# Altium project PV Refridgerator.PrjPCB (part 1 of 3)
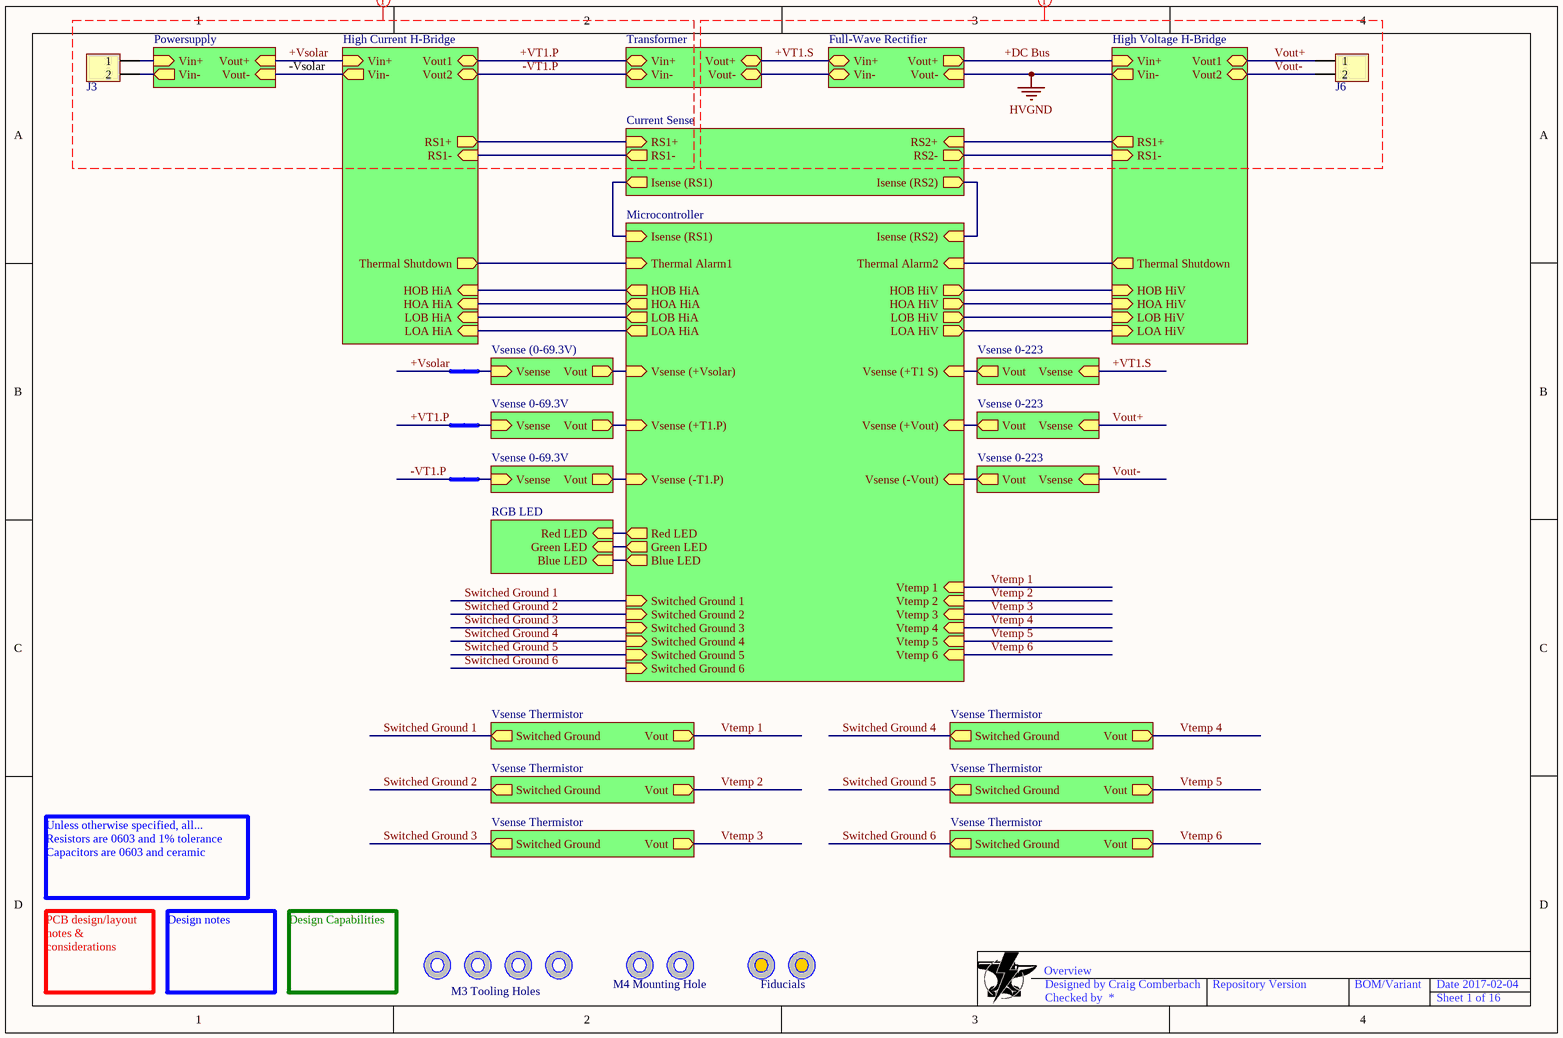
[diagram p0: Overview.SchDoc]
Designer: Craig Comberbach; ProjectRevision: v0.1.3; ProjectTitle: PV Refridgerator
19 sheets, 199 parts. Net scope: hierarchical (ports join the sheet entries above them; power ports are global).
Board file: PV Refridgerator v0.1.3.PCBDOC
Sheets:
  Overview.SchDoc
    High Current H-Bridge = High Current H-Bridge.SchDoc
      Half H-Bridge Driver = Half H-Bridge Driver.SchDoc
      Half H-Bridge Driver = Half H-Bridge Driver.SchDoc
      Emergency Thermal Shutdown = Emergency Thermal Shutdown.SchDoc
    Full-Wave Rectifier = Full-Wave Rectifier.schdoc
    High Voltage H-Bridge = High Voltage H-Bridge.SchDoc
      Half H-Bridge Driver = Half H-Bridge Driver.SchDoc
      Half H-Bridge Driver = Half H-Bridge Driver.SchDoc
      Emergency Thermal Shutdown = Emergency Thermal Shutdown.SchDoc
    Transformer = Transformer.SchDoc
    Powersupply = Powersupply.SchDoc
      15VDC 500mA Boost SMPS = 15VDC 500mA Boost SMPS.SchDoc
      3.3VDC 250mA Linear PS = 3.3VDC 250mA Linear PS.SchDoc
      5VDC 250mA Buck SMPS = 5VDC 250mA Buck SMPS.SchDoc
    Microcontroller = Microcontroller.SchDoc
      ICSP = ICSP.SchDoc
    RGB LED = RGB LED.SchDoc
    Vsense 0-69.3V = Vsense 0-69.3V.SchDoc
    Vsense 0-223 = Vsense 0-223.3V.SchDoc
    Vsense Thermistor = Vsense Thermistor.SchDoc
    Current Sense = Current Sense.SchDoc
    Vsense (0-69.3V) = Vsense 0-69.3V.SchDoc
    Vsense 0-69.3V = Vsense 0-69.3V.SchDoc
    Vsense 0-223 = Vsense 0-223.3V.SchDoc
    Vsense 0-223 = Vsense 0-223.3V.SchDoc
    Vsense Thermistor = Vsense Thermistor.SchDoc
    Vsense Thermistor = Vsense Thermistor.SchDoc
    Vsense Thermistor = Vsense Thermistor.SchDoc
    Vsense Thermistor = Vsense Thermistor.SchDoc
    Vsense Thermistor = Vsense Thermistor.SchDoc
  Reverse Voltage Protection.SchDoc

## Sheet Overview.SchDoc: Overview
size A4; Date: 2017-02-04; DocumentNumber: 1; Revision: C; SheetNumber: 1; SheetTotal: 16; DesignedBy: Craig Comberbach

### Parts
FID1  Fiducials  [Fiducial]  (no BOM)
FID3  Fiducial  [Fiducial]  (value not drawn)  (no BOM)
J3  Terminal Block - 2-Position HiV/HiA  [TE 796739-2]  (value not drawn)
J6  Terminal Block - 2-Position HiV/HiA  [TE 796739-2]  (value not drawn)
MountingHole1  M3 Tooling Holes  [M3 Screw - One Sided]  (no BOM)
MountingHole2  Mounting Hole  [M3 Screw - One Sided]  (value not drawn)  (no BOM)
MountingHole3  Mounting Hole  [M4 Screw - One Sided]  (value not drawn)  (no BOM)
MountingHole4  M4 Mounting Hole  [M4 Screw - One Sided]  (no BOM)
MountingHole5  Mounting Hole  [M3 Screw - One Sided]  (value not drawn)  (no BOM)
MountingHole6  Mounting Hole  [M3 Screw - One Sided]  (value not drawn)  (no BOM)
NetTie7  Net Tie - Same Size  (value not drawn)  (net tie, no BOM)
NetTie8  Net Tie - Same Size  (value not drawn)  (net tie, no BOM)
NetTie9  Net Tie - Same Size  (value not drawn)  (net tie, no BOM)

### Sub-sheets
Current Sense = Current Sense.SchDoc: RS1+ (in), RS1- (out), RS2+ (in), RS2- (out), Isense (RS1) (out), Isense (RS2) (out)
Full-Wave Rectifier = Full-Wave Rectifier.SchDoc: Vin+ (bidir), Vin- (bidir), Vout+ (out), Vout- (in)
High Current H-Bridge = High Current H-Bridge.SchDoc: Vout1 (bidir), Vout2 (bidir), Vin+ (in), Vin- (out), RS1+ (out), RS1- (in), HOB HiA (in), LOB HiA (in), LOA HiA (in), HOA HiA (in), Thermal Shutdown (out)
High Voltage H-Bridge = High Voltage H-Bridge.SchDoc: Vout1 (bidir), Vout2 (bidir), Vin+ (in), Vin- (out), RS1+ (out), RS1- (in), HOB HiV (in), HOA HiV (in), LOA HiV (in), LOB HiV (in), Thermal Shutdown (out)
Microcontroller = Microcontroller.SchDoc: Red LED (out), Green LED (out), Blue LED (out), Vsense (+T1.P) (in), Vsense (+Vsolar) (in), Vsense (-T1.P) (in), Vsense (+T1 S) (in), Vtemp 6 (in), Vsense (+Vout) (in), Vsense (-Vout) (in), Vtemp 1 (in), Vtemp 2 (in), Vtemp 3 (in), Vtemp 4 (in), Vtemp 5 (in), Isense (RS1) (in), Isense (RS2) (in), Switched Ground 1 (in), Switched Ground 2 (in), Switched Ground 3 (in), Switched Ground 4 (in), Switched Ground 5 (in), HOB HiA (out), LOB HiA (out), LOA HiA (out), HOA HiA (out), HOB HiV (out), HOA HiV (out), LOA HiV (out), LOB HiV (out), Switched Ground 6 (in), Thermal Alarm1 (in), Thermal Alarm2 (in)
Powersupply = Powersupply.SchDoc: Vin+ (in), Vin- (out), Vout- (in), Vout+ (in)
RGB LED = RGB LED.SchDoc: Red LED (in), Green LED (in), Blue LED (in)
Transformer = Transformer.SchDoc: Vin+ (bidir), Vin- (bidir), Vout+ (bidir), Vout- (bidir)
Vsense 0-69.3V = Vsense 0-69.3V.SchDoc: Vsense (in), Vout (out)
Vsense 0-69.3V = Vsense 0-69.3V.SchDoc: Vsense (in), Vout (out)
Vsense 0-223 = Vsense 0-223.3V.SchDoc: Vsense (in), Vout (out)
Vsense 0-223 = Vsense 0-223.3V.SchDoc: Vsense (in), Vout (out)
Vsense 0-223 = Vsense 0-223.3V.SchDoc: Vsense (in), Vout (out)
Vsense (0-69.3V) = Vsense 0-69.3V.SchDoc: Vsense (in), Vout (out)
Vsense Thermistor = Vsense Thermistor.SchDoc: Switched Ground (out), Vout (out)
Vsense Thermistor = Vsense Thermistor.SchDoc: Switched Ground (out), Vout (out)
Vsense Thermistor = Vsense Thermistor.SchDoc: Switched Ground (out), Vout (out)
Vsense Thermistor = Vsense Thermistor.SchDoc: Switched Ground (out), Vout (out)
Vsense Thermistor = Vsense Thermistor.SchDoc: Switched Ground (out), Vout (out)
Vsense Thermistor = Vsense Thermistor.SchDoc: Switched Ground (out), Vout (out)

### Nets
HVGND: sheet Full-Wave Rectifier/Vout-, sheet High Voltage H-Bridge/Vin-, sheet High Voltage H-Bridge/RS1-, sheet Current Sense/RS2-
+DC Bus: sheet Full-Wave Rectifier/Vout+, sheet High Voltage H-Bridge/Vin+
+Vsolar: J3.1 NetTie7.1 ; sheet High Current H-Bridge/Vin+, sheet Powersupply/Vin+, sheet Powersupply/Vout+
+VT1.P: NetTie8.1 ; sheet High Current H-Bridge/Vout1, sheet Transformer/Vin+
+VT1.S: sheet Full-Wave Rectifier/Vin+, sheet Transformer/Vout+, sheet Vsense 0-223/Vsense
-Vsolar: J3.2 ; sheet High Current H-Bridge/Vin-, sheet High Current H-Bridge/RS1-, sheet Powersupply/Vin-, sheet Powersupply/Vout-, sheet Current Sense/RS1-
-VT1.P: NetTie9.1 ; sheet High Current H-Bridge/Vout2, sheet Transformer/Vin-
Isense (RS1): sheet Microcontroller/Isense (RS1), sheet Current Sense/Isense (RS1)
Isense (RS2): sheet Microcontroller/Isense (RS2), sheet Current Sense/Isense (RS2)
Switched Ground 1: sheet Microcontroller/Switched Ground 1, sheet Vsense Thermistor/Switched Ground
Switched Ground 2: sheet Microcontroller/Switched Ground 2, sheet Vsense Thermistor/Switched Ground
Switched Ground 3: sheet Microcontroller/Switched Ground 3, sheet Vsense Thermistor/Switched Ground
Switched Ground 4: sheet Microcontroller/Switched Ground 4, sheet Vsense Thermistor/Switched Ground
Switched Ground 5: sheet Microcontroller/Switched Ground 5, sheet Vsense Thermistor/Switched Ground
Switched Ground 6: sheet Microcontroller/Switched Ground 6, sheet Vsense Thermistor/Switched Ground
Vout+: J6.1 ; sheet High Voltage H-Bridge/Vout1, sheet Vsense 0-223/Vsense  [project net C_VS]
Vout-: J6.2 ; sheet High Voltage H-Bridge/Vout2, sheet Vsense 0-223/Vsense  [project net D_VS]
Vsense (+T1 S): sheet Microcontroller/Vsense (+T1 S), sheet Vsense 0-223/Vout
Vsense (+T1.P): sheet Microcontroller/Vsense (+T1.P), sheet Vsense 0-69.3V/Vout
Vsense (+Vout): sheet Microcontroller/Vsense (+Vout), sheet Vsense 0-223/Vout
Vsense (+Vsolar): sheet Microcontroller/Vsense (+Vsolar), sheet Vsense (0-69.3V)/Vout
Vsense (-T1.P): sheet Microcontroller/Vsense (-T1.P), sheet Vsense 0-69.3V/Vout
Vsense (-Vout): sheet Microcontroller/Vsense (-Vout), sheet Vsense 0-223/Vout
Vtemp 1: sheet Microcontroller/Vtemp 1, sheet Vsense Thermistor/Vout
Vtemp 2: sheet Microcontroller/Vtemp 2, sheet Vsense Thermistor/Vout
Vtemp 3: sheet Microcontroller/Vtemp 3, sheet Vsense Thermistor/Vout
Vtemp 4: sheet Microcontroller/Vtemp 4, sheet Vsense Thermistor/Vout
Vtemp 5: sheet Microcontroller/Vtemp 5, sheet Vsense Thermistor/Vout
Vtemp 6: sheet Microcontroller/Vtemp 6, sheet Vsense Thermistor/Vout
NetD2_1: sheet Full-Wave Rectifier/Vin-, sheet Transformer/Vout-
NetD5_1: sheet Microcontroller/Red LED, sheet RGB LED/Red LED
NetD6_1: sheet Microcontroller/Green LED, sheet RGB LED/Green LED
NetD7_1: sheet Microcontroller/Blue LED, sheet RGB LED/Blue LED
NetNetTie3_2: sheet High Current H-Bridge/RS1+, sheet Current Sense/RS1+
NetNetTie5_2: sheet High Voltage H-Bridge/RS1+, sheet Current Sense/RS2+
NetNetTie7_2: NetTie7.2 ; sheet Vsense (0-69.3V)/Vsense
NetNetTie8_2: NetTie8.2 ; sheet Vsense 0-69.3V/Vsense
NetNetTie9_2: NetTie9.2 ; sheet Vsense 0-69.3V/Vsense
NetR1A_1: sheet High Current H-Bridge/Thermal Shutdown, sheet Microcontroller/Thermal Alarm1
NetR1B_1: sheet High Voltage H-Bridge/Thermal Shutdown, sheet Microcontroller/Thermal Alarm2
NetU1#2_31: sheet High Voltage H-Bridge/LOA HiV, sheet Microcontroller/LOA HiV
NetU1#2_32: sheet High Voltage H-Bridge/LOB HiV, sheet Microcontroller/LOB HiV
NetU1#2_33: sheet High Voltage H-Bridge/HOA HiV, sheet Microcontroller/HOA HiV
NetU1#2_34: sheet High Voltage H-Bridge/HOB HiV, sheet Microcontroller/HOB HiV
NetU1#2_42: sheet High Current H-Bridge/HOA HiA, sheet Microcontroller/HOA HiA
NetU1#2_46: sheet High Current H-Bridge/HOB HiA, sheet Microcontroller/HOB HiA
NetU1#2_52: sheet High Current H-Bridge/LOB HiA, sheet Microcontroller/LOB HiA
NetU1#2_53: sheet High Current H-Bridge/LOA HiA, sheet Microcontroller/LOA HiA

### Layout directives
net class 15A: +Vsolar, +VT1.P, -Vsolar, -VT1.P
net class 171-250V: +DC Bus, +VT1.S, HVGND, Vout+, Vout-

### Notes on the sheet
- Unless otherwise specified, all...
  Resistors are 0603 and 1% tolerance
  Capacitors are 0603 and ceramic
- PCB design/layout notes & considerations
- Design notes
- (near MountingHole1) Design Capabilities
- Repository Version
- BOM/Variant

### Library data of the parts
FID1 = Fiducial: Value: Fiducial
J3 J6 = Terminal Block - 2-Position HiV/HiA: Manufacturer: TE Connectivity AMP Connectors; Manufacturer Part Number: 796739-2; Number of Levels: 1; Positions Per Level: 2; Pitch: 0.375" (9.53mm); Mating Orientation: Horizontal with Board; Current: 30A; Voltage: 600V; Wire Gauge: 10-30 AWG; Wire Termination: Screw - Rising Cage Clamp; Clamp Material - Plating: Brass - Nickel Plated; Torque - Screw: 0.79 Nm (7.0 Lb-In); Screw Thread: M3; Supplier 1: Digi-Key; RoHS: RoHS Compliant; Category: Connectors, Interconnects; Stock 1: 14124; Pricing 1: 1=2.21, 10=1.673, 25=1.5504, 50=1.394, 100=1.36, 250=1.19, 500=1.088, 1000=0.986, 2500=0.884 (USD); Packaging: Tray; Part Status: Active; Mounting Type: Through Hole; Features: Interlocking (Side); Color: Green; Operating Temperature: -; Housing Material: Polyamide (PA66), Nylon 6/6; Contact Material - Plating: -; Screw Material - Plating: Brass - Nickel Plated; ComponentLink1URL: http://www.te.com/commerce/DocumentDelivery/DDEController?Action=srchrtrv&DocNm=796739&DocType=Customer+Drawing&DocLang=English; ComponentLink1Description: Spec Sheet; Supplier Part Number 1: A98273-ND
MountingHole1 MountingHole4 = Mounting Hole
NetTie7-NetTie9 = Net Tie - Same Size: Ties two nets together
FID3 = Fiducial: Value: Fiducial

## Sheet High Current H-Bridge.SchDoc: Title
size A4; Date: Date; CheckedBy: Checked By; SheetNumber: x; SheetTotal: y; DesignedBy: Designed By
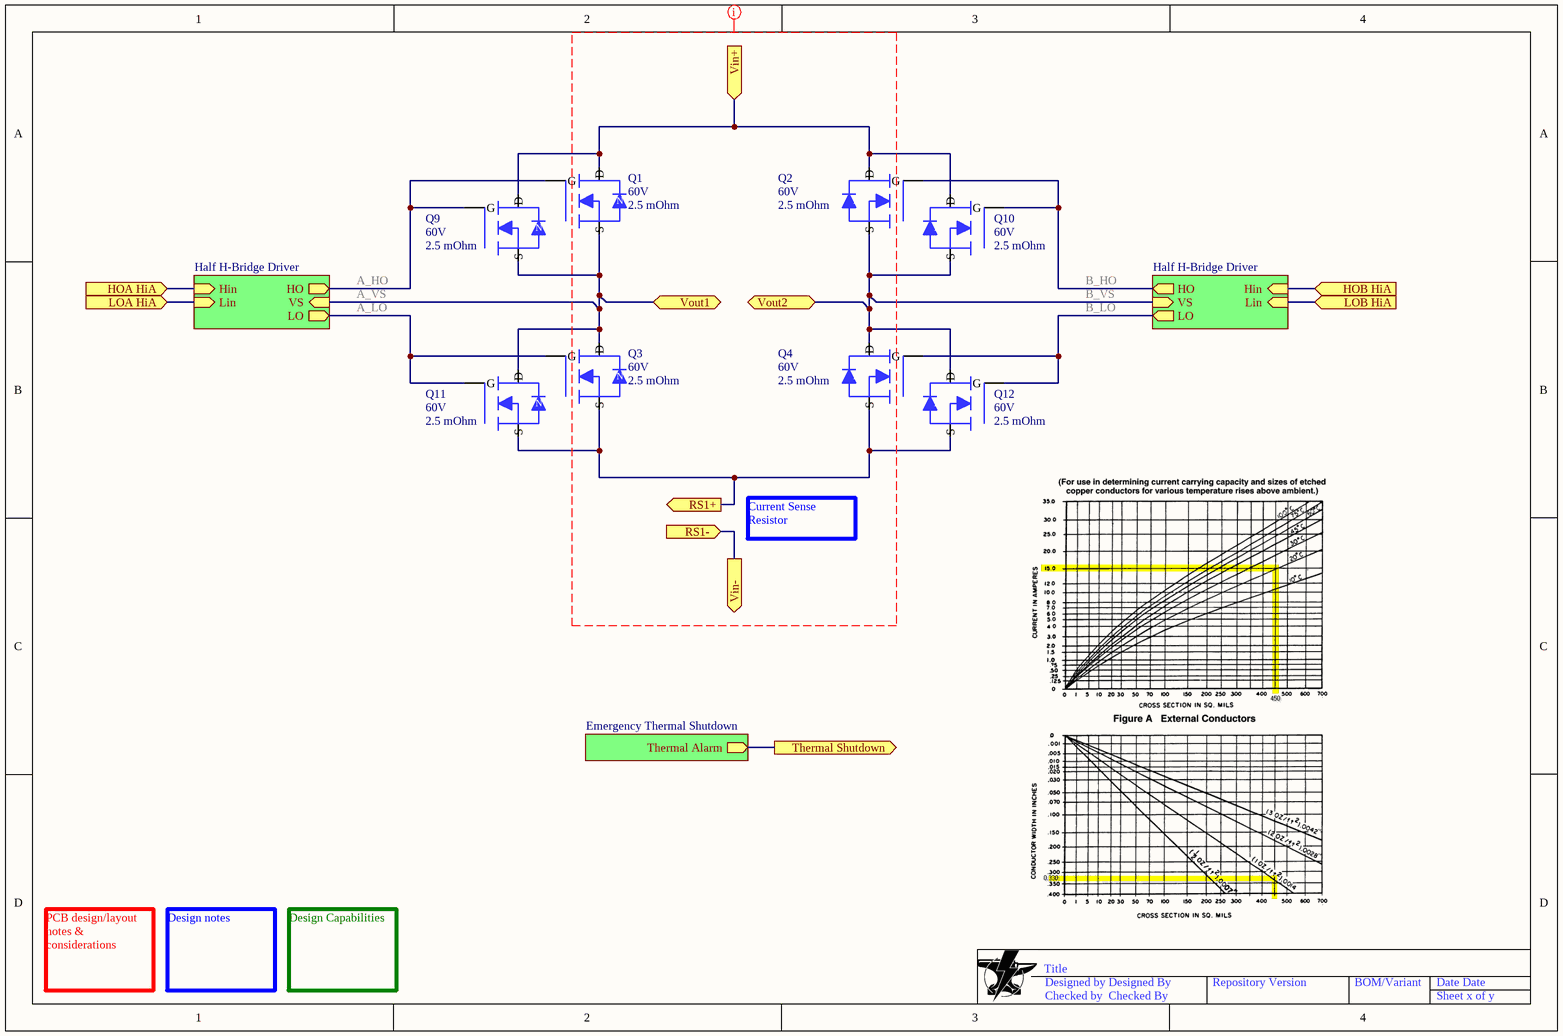
[diagram p1: High Current H-Bridge.SchDoc]

### Parts
Q1  Drain to Source Voltage (Vdss): 60V  Rds On (Max) @ Id, Vgs: 2.5 mOhm  [DPAK]  (hidden comment: N-MOSFET)
Q2  Drain to Source Voltage (Vdss): 60V  Rds On (Max) @ Id, Vgs: 2.5 mOhm  [DPAK]  (hidden comment: N-MOSFET)
Q3  Drain to Source Voltage (Vdss): 60V  Rds On (Max) @ Id, Vgs: 2.5 mOhm  [DPAK]  (hidden comment: N-MOSFET)
Q4  Drain to Source Voltage (Vdss): 60V  Rds On (Max) @ Id, Vgs: 2.5 mOhm  [DPAK]  (hidden comment: N-MOSFET)
Q9  Drain to Source Voltage (Vdss): 60V  Rds On (Max) @ Id, Vgs: 2.5 mOhm  [DPAK]  (hidden comment: N-MOSFET)
Q10  Drain to Source Voltage (Vdss): 60V  Rds On (Max) @ Id, Vgs: 2.5 mOhm  [DPAK]  (hidden comment: N-MOSFET)
Q11  Drain to Source Voltage (Vdss): 60V  Rds On (Max) @ Id, Vgs: 2.5 mOhm  [DPAK]  (hidden comment: N-MOSFET)
Q12  Drain to Source Voltage (Vdss): 60V  Rds On (Max) @ Id, Vgs: 2.5 mOhm  [DPAK]  (hidden comment: N-MOSFET)

### Sub-sheets
Emergency Thermal Shutdown = Emergency Thermal Shutdown.SchDoc: Thermal Alarm (out)
Half H-Bridge Driver = Half H-Bridge Driver.SchDoc: HO (out), VS (in), LO (out), Hin (in), Lin (in)
Half H-Bridge Driver = Half H-Bridge Driver.SchDoc: HO (out), VS (in), LO (out), Hin (in), Lin (in)

### Ports
HOA HiA (in), HOB HiA (in), LOA HiA (in), LOB HiA (in), RS1+ (out), RS1- (in), Thermal Shutdown (out), Vin+ (in), Vin- (out), Vout1 (bidir), Vout2 (bidir)

### Nets
+Vsolar: Q1.2(D) Q2.2(D) Q9.2(D) Q10.2(D) ; port Vin+
-Vsolar: port Vin-, port RS1-
A_HO: Q1.1(G) Q9.1(G) ; sheet Half H-Bridge Driver/HO
A_LO: Q3.1(G) Q11.1(G) ; sheet Half H-Bridge Driver/LO
A_VS: Q1.3(S) Q3.2(D) Q9.3(S) Q11.2(D) ; port Vout1, sheet Half H-Bridge Driver/VS  [project net +VT1.P]
B_HO: Q2.1(G) Q10.1(G) ; sheet Half H-Bridge Driver/HO
B_LO: Q4.1(G) Q12.1(G) ; sheet Half H-Bridge Driver/LO
B_VS: Q2.3(S) Q4.2(D) Q10.3(S) Q12.2(D) ; port Vout2, sheet Half H-Bridge Driver/VS  [project net -VT1.P]
NetNetTie3_2: Q3.3(S) Q4.3(S) Q11.3(S) Q12.3(S) ; port RS1+
NetR1A_1: port Thermal Shutdown, sheet Emergency Thermal Shutdown/Thermal Alarm
NetU1#2_42: port HOA HiA, sheet Half H-Bridge Driver/Hin
NetU1#2_46: port HOB HiA, sheet Half H-Bridge Driver/Hin
NetU1#2_52: port LOB HiA, sheet Half H-Bridge Driver/Lin
NetU1#2_53: port LOA HiA, sheet Half H-Bridge Driver/Lin

### Layout directives
net class 15A: (no net found under the mark)

### Notes on the sheet
- Current Sense Resistor
- PCB design/layout notes & considerations
- Design notes
- Design Capabilities
- Repository Version
- BOM/Variant
- (in symbol N-MOSFET 2.5mR 60V) N

### Library data of the parts
Q1-Q4 Q9-Q12 = N-MOSFET 2.5mR 60V: Manufacturer: Infineon Technologies; Manufacturer Part Number: IPD025N06N; FET Type: N-Channel; Current - Continuous Drain (Id) @ 25°C: 90A; Drive Voltage (Max Rds On,  Min Rds On): 6V, 10V; Vgs(th) (Max) @ Id: 2.8V @ 95µA; Gate Charge (Qg) (Max) @ Vgs: 71nC @ 10V; Input Capacitance (Ciss) (Max) @ Vds: 5200pF @ 30V; Vgs (Max): ±20V; Power Dissipation (Max): 3W (Ta), 167W (Tc); Supplier 1: Digi-Key; Supplier Part Number 1: IPD025N06NCT-ND; RoHS: RoHS Compliant; Category: Discrete Semiconductor Products; Stock 1: 5405; Pricing 1: 1=1.91, 10=1.72, 100=1.3822, 500=1.13558, 1000=0.94091 (USD); Packaging: Cut Tape (CT); Part Status: Active; Technology: MOSFET (Metal Oxide); FET Feature: -; Operating Temperature: -55°C ~ 175°C (TJ); Mounting Type: Surface Mount; Supplier Device Package: PG-TO252-3; Package / Case: TO-252-3, DPak (2 Leads + Tab), SC-63; ComponentLink1URL: http://www.infineon.com/dgdl/IPD025N06N_Rev2+1.pdf?folderId=db3a304313b8b5a60113cee8763b02d7&fileId=db3a304336415dec0136531648062c76; ComponentLink1Description: Spec Sheet; Value: N-MOSFET 2.5mR

## Sheet Half H-Bridge Driver.SchDoc: N-FET Driver
size A4; Date: 2017-02-04; DocumentNumber: 3; Revision: A; SheetNumber: 3; SheetTotal: 16; DesignedBy: Mike MacKay
Used 4 times, as channels High Current H-Bridge/Half H-Bridge Driver, High Current H-Bridge/Half H-Bridge Driver, High Voltage H-Bridge/Half H-Bridge Driver, High Voltage H-Bridge/Half H-Bridge Driver. Parts and nets are listed once, with the designators drawn on the sheet.
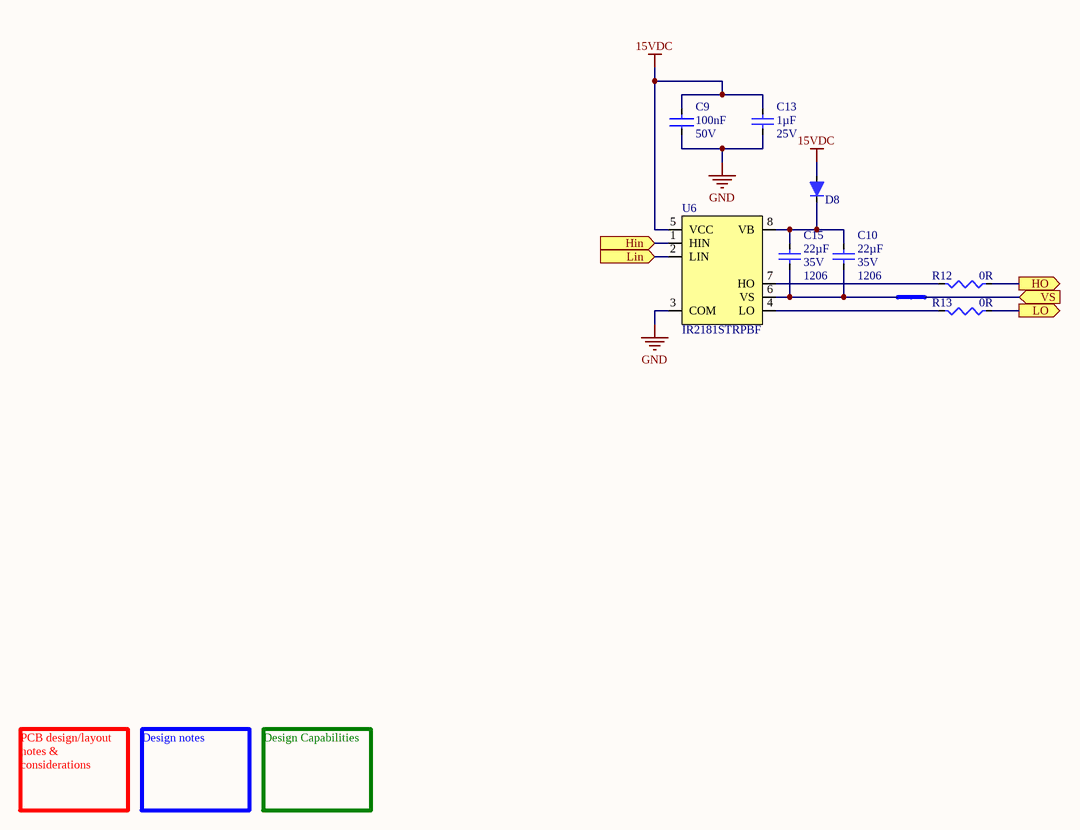
[diagram p2: Half H-Bridge Driver.SchDoc]

### Parts
C9  Voltage - Rated: 50V  Capacitance: 100nF  [C0603 - Ceramic]  (hidden comment: 100nF 0603 50V)
C10  Capacitance: 22µF  Voltage - Rated: 35V  Package / Case: 1206  (hidden comment: 22uF 1206 35V)
C13  Voltage - Rated: 25V  Capacitance: 1µF  [Capacitor - 0603 Ceramic]  (hidden comment: 1uF 0603 25V)
C15  Voltage - Rated: 35V  Package / Case: 1206  Capacitance: 22µF  (hidden comment: 22uF 1206 35V)
D8  (no value)
NetTie1  Net Tie - Same Size  (value not drawn)  (net tie, no BOM)
R12  Resistance (Ohms): 0R  [R0603]  (hidden comment: 0R 0603)
R13  Resistance (Ohms): 0R  [R0603]  (hidden comment: 0R 0603)
U6  Manufacturer Part Number: IR2181STRPBF  [SOIC-8]  (hidden comment: H-Bridge Driver)

### Ports
Hin (in), HO (out), Lin (in), LO (out), VS (in)

### Nets
15VDC: C9.1 C13.1 D8.1(Anode) U6.5(VCC)
GND: C9.2 C13.2 U6.3(COM)
Hin: U6.1(HIN) ; port Hin
HO: R12.2 ; port HO
Lin: U6.2(LIN) ; port Lin
LO: R13.2 ; port LO
VS: NetTie1.1 ; port VS
NetC10_1: C10.1 C15.1 D8.2(Cathode) U6.8(VB)
NetC10_2: C10.2 C15.2 NetTie1.2 U6.6(VS)
NetR12_1: R12.1 U6.7(HO)
NetR13_1: R13.1 U6.4(LO)

### Channels
High Current H-Bridge/Half H-Bridge Driver: designators end in A; ports Hin=NetU1#2_42 HO=A_HO Lin=NetU1#2_53 LO=A_LO VS=+VT1.P
High Current H-Bridge/Half H-Bridge Driver: designators end in B; ports Hin=NetU1#2_46 HO=B_HO Lin=NetU1#2_52 LO=B_LO VS=-VT1.P
High Voltage H-Bridge/Half H-Bridge Driver: designators end in C; ports Hin=NetU1#2_33 HO=C_HO Lin=NetU1#2_31 LO=C_LO VS=C_VS
High Voltage H-Bridge/Half H-Bridge Driver: designators end in D; ports Hin=NetU1#2_34 HO=D_HO Lin=NetU1#2_32 LO=D_LO VS=D_VS

### Notes on the sheet
- PCB design/layout notes & considerations
- Design notes
- Design Capabilities
- Repository Version
- BOM/Variant

### Library data of the parts
C9 = 100nF 0603 50V: Manufacturer: Samsung Electro-Mechanics America, Inc; Manufacturer Part Number: CL10B104KB8SFNC; Tolerance: ±10%; Temperature Coefficient: X7R; Value: 100nF 0603 50V; Supplier 1: Digi-Key; RoHS: RoHS Compliant; Category: Capacitors; Stock 1: 1192070; Pricing 1: 1=0.1, 10=0.027, 25=0.0192, 100=0.0125, 500=0.00874, 1000=0.00681 (USD); Packaging: Cut Tape (CT); Mounting Type: Surface Mount, MLCC; Operating Temperature: -55°C ~ 125°C; Applications: Boardflex Sensitive; Ratings: -; Package / Case: 0603 (1608 Metric); Size / Dimension: 0.063" L x 0.031" W (1.60mm x 0.80mm); Height - Seated (Max): -; Thickness (Max): 0.035" (0.90mm); Lead Spacing: -; Features: Soft Termination; Lead Style: -; ComponentLink1URL: http://www.samsungsem.com/kr/front/downloadcms.do?path=/kr/support/product-search/mlcc/__icsFiles/afieldfile/2014/11/05&fileName=S_CL10B104KB8SFNC.pdf; ComponentLink1Description: Spec Sheet; Supplier Part Number 1: 1276-1936-1-ND
C10 C15 = 22uF 1206 35V: Non-polarized; Manufacturer: TDK Corporation; Manufacturer Part Number: C3216X5R1V226M160AC; Tolerance: ±20%; Temperature Coefficient: X5R; Value: 22uF 1206 35V; Supplier 1: Digi-Key; RoHS: RoHS Compliant; Category: Capacitors; Stock 1: 661971; Pricing 1: 1=1.06, 10=0.835, 100=0.6262, 500=0.47312, 1000=0.41745 (USD); Packaging: Cut Tape (CT); Part Status: Active; Operating Temperature: -55°C ~ 85°C; Features: Low ESL; Ratings: -; Applications: General Purpose; Failure Rate: -; Mounting Type: Surface Mount, MLCC; Size / Dimension: 0.126" L x 0.063" W (3.20mm x 1.60mm); Height - Seated (Max): -; Thickness (Max): 0.071" (1.80mm); Lead Spacing: -; Lead Style: -; ComponentLink1URL: https://product.tdk.com/info/en/catalog/datasheets/mlcc_commercial_general_en.pdf; ComponentLink1Description: Spec Sheet; Supplier Part Number 1: 445-8045-1-ND
C13 = 1uF 0603 25V: Non-polarized; Manufacturer: Murata Electronics North America; Manufacturer Part Number: GRM188R61E105KA12D; Value: 1uF 0603 16V; Tolerance: ±10%; Temperature Coefficient: X5R; Supplier 1: Digi-Key; RoHS: RoHS Compliant; Category: Capacitors; Stock 1: 1582906; Pricing 1: 1=0.14, 10=0.059, 50=0.0322, 100=0.0273, 250=0.02232, 500=0.01908, 1000=0.01488 (CAD); Packaging: Cut Tape (CT); Mounting Type: Surface Mount, MLCC; Operating Temperature: -55°C ~ 85°C; Applications: General Purpose; Ratings: -; Package / Case: 0603 (1608 Metric); Size / Dimension: 0.063" L x 0.031" W (1.60mm x 0.80mm); Height - Seated (Max): -; Thickness (Max): 0.035" (0.90mm); Lead Spacing: -; Features: -; Lead Style: -; ComponentLink1URL: http://www.murata.com/~/media/webrenewal/support/library/catalog/products/capacitor/mlcc/c02e.ashx; ComponentLink1Description: Spec Sheet; Supplier Part Number 1: 490-3897-1-ND
D8 = Diode - Signal 1A: Signal Diode; Manufacturer: Vishay Semiconductor Diodes Division; Manufacturer Part Number: US1G-E3/5AT; Diode Type: Standard; Voltage - DC Reverse (Vr) (Max): 400V; Current - Average Rectified (Io): 1A; Voltage - Forward (Vf) (Max) @ If: 1V @ 1A; Speed: Fast Recovery =< 500ns, > 200mA (Io); Reverse Recovery Time (trr): 50ns; Current - Reverse Leakage @ Vr: 10µA @ 400V; Capacitance @ Vr, F: 15pF @ 4V, 1MHz; Supplier 1: Digi-Key; Supplier Part Number 1: US1G-E3/5ATGICT-ND; RoHS: RoHS Compliant; Category: Discrete Semiconductor Products; Stock 1: 29002; Pricing 1: 1=0.41, 10=0.312, 25=0.2816, 100=0.1945, 250=0.1638, 500=0.1331, 1000=0.10238, 2500=0.09214 (USD); Packaging: Cut Tape (CT); Part Status: Active; Mounting Type: Surface Mount; Package / Case: DO-214AC, SMA; ComponentLink1URL: http://www.vishay.com/docs/88768/us1.pdf; ComponentLink1Description: Spec Sheet; Supplier Device Package: DO-214AC (SMA); Operating Temperature - Junction: -55°C ~ 150°C
NetTie1 = Net Tie - Same Size: Ties two nets together
R12 R13 = 0R 0603: Manufacturer: Yageo; Manufacturer Part Number: RC0603JR-070RL; Tolerance: Jumper; Power (Watts): 0.1W, 1/10W; Value: 0R 0603; Supplier 1: Digi-Key; Supplier Part Number 1: 311-0.0GRCT-ND; RoHS: RoHS Compliant; Category: Resistors; Stock 1: 9876788; Pricing 1: 1=0.1, 10=0.01, 25=0.0072, 50=0.0056, 100=0.0041, 250=0.00316, 500=0.00252, 1000=0.00186 (USD); Packaging: Cut Tape (CT); Part Status: Active; Composition: Thick Film; Features: Moisture Resistant; Temperature Coefficient: -; Operating Temperature: -55°C ~ 155°C; Package / Case: 0603 (1608 Metric); Supplier Device Package: 0603; Size / Dimension: 0.063" L x 0.031" W (1.60mm x 0.80mm); Height - Seated (Max): 0.022" (0.55mm); Failure Rate: -; ComponentLink1URL: http://www.yageo.com/documents/recent/PYu-RC_Group_51_RoHS_L_7.pdf; ComponentLink1Description: Spec Sheet
U6 = H-Bridge Driver: Manufacturer: Infineon Technologies; Driven Configuration: Half-Bridge; Channel Type: Independent; Gate Type: IGBT, N-Channel MOSFET; Voltage - Supply: 10 V ~ 20 V; Logic Voltage - VIL, VIH: 0.8V, 2.7V; Current - Peak Output (Source, Sink): 1.9A, 2.3A; Input Type: Non-Inverting; High Side Voltage - Max (Bootstrap): 600V; Rise / Fall Time (Typ): 40ns, 20ns; Supplier 1: Digi-Key; RoHS: RoHS Compliant; Category: Integrated Circuits (ICs); Stock 1: 2915; Pricing 1: 1=3.06, 10=2.75, 100=2.2535, 500=1.9184, 1000=1.61792 (USD); Packaging: Cut Tape (CT); Part Status: Active; Operating Temperature: -40°C ~ 150°C (TJ); Mounting Type: Surface Mount; Package / Case: 8-SOIC (0.154", 3.90mm Width); Supplier Device Package: 8-SOIC; ComponentLink1URL: http://www.irf.com/product-info/datasheets/data/ir2181.pdf; ComponentLink1Description: Spec Sheet; Supplier Part Number 1: IR2181SPBFCT-ND

## Sheet Emergency Thermal Shutdown.SchDoc: Emergency Thermal Shutdown
size A4; Date: 2017-08-06; Revision: A; DesignedBy: Craig Comberbach
Used 2 times, as channels High Current H-Bridge/Emergency Thermal Shutdown, High Voltage H-Bridge/Emergency Thermal Shutdown. Parts and nets are listed once, with the designators drawn on the sheet.
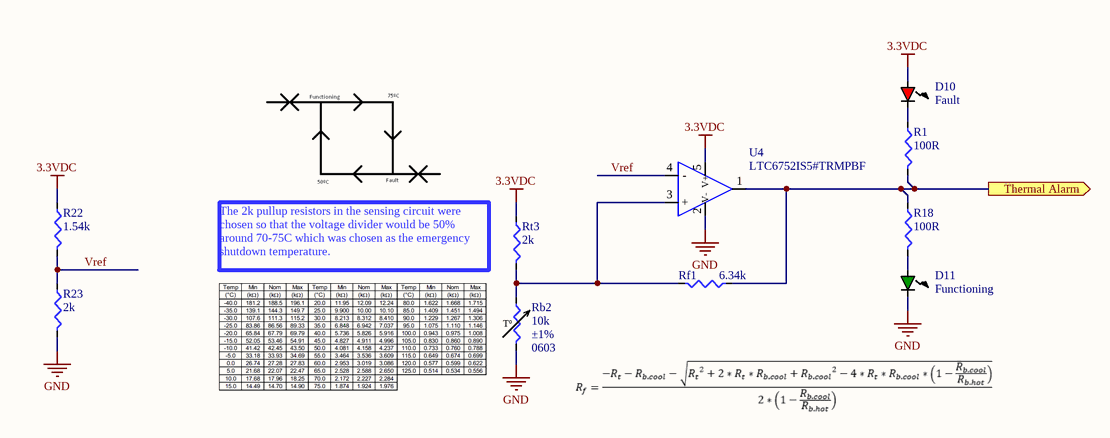
[diagram p3: Emergency Thermal Shutdown.SchDoc]

### Parts
D10  Fault  [LED - 1206 Red]
D11  Functioning  [LED - 1206 Green]
R1  Resistance (Ohms): 100R  [R0603]  (hidden comment: 100R 0603 1%)
R18  Resistance (Ohms): 100R  [R0603]  (hidden comment: 100R 0603 1%)
R22  Resistance: 1.54k  [R0603]  (hidden comment: 1.54k 0603 1%)
R23  Resistance (Ohms): 2k  [R0603]  (hidden comment: 2k 0603 1%)
Rb2  Resistance in Ohms @ 25°C: 10k  Resistance Tolerance: ±1%  Package / Case: 0603  (hidden comment: Thermistor 10k Type J SMT)  (mechanical)
Rf1  Resistance: 6.34k  [R0603]  (hidden comment: 6.34k 0603 1%)
Rt3  Resistance (Ohms): 2k  [R0603]  (hidden comment: 2k 0603 1%)
U4  Manufacturer Part Number: LTC6752IS5#TRMPBF  (hidden comment: Single Comparator LTC6752)

### Ports
Thermal Alarm (out)

### Nets
3.3VDC: D10.1 R22.2 Rt3.2 U4.5(V+)
GND: D11.2 R23.1 Rb2.2 U4.2(V-)
Thermal Alarm: R1.1 R18.2 Rf1.2 U4.1(Out) ; port Thermal Alarm
Vref: R22.1 R23.2 U4.4(-)
NetD10_2: D10.2 R1.2
NetD11_1: D11.1 R18.1
NetRb2_1: Rb2.1 Rf1.1 Rt3.1 U4.3(+)

### Channels
High Current H-Bridge/Emergency Thermal Shutdown: designators end in A; ports Thermal Alarm=NetR1A_1
High Voltage H-Bridge/Emergency Thermal Shutdown: designators end in B; ports Thermal Alarm=NetR1B_1

### Notes on the sheet
- The 2k pullup resistors in the sensing circuit were chosen so that the voltage divider would be 50% around 70-75C which was chosen as the emergency shutdown temperature.
- Repository Version
- BOM/Variant
- (in symbol Thermistor 10k Type J SMT) Tº

### Library data of the parts
D10 = Red LED 1206: Manufacturer: Kingbright; Manufacturer Part Number: APT3216SRCPRV; Color: Red; Wavelength - Dominant: 640nm; Wavelength - Peak: 660nm; Millicandela Rating: 80mcd; Voltage - Forward (Vf) (Typ): 1.85V; Current - Test: 20mA; Viewing Angle: 120°; Lens Type: Clear; Lens Style/Size: Rectangle with Flat Top, 2mm x 1.6mm; Value: Red LED 1206; Supplier 1: Digi-Key; RoHS: RoHS Compliant; Category: Optoelectronics; Stock 1: 29504; Pricing 1: 1=0.2, 10=0.149, 25=0.1188, 100=0.1073, 250=0.099, 500=0.0891 (USD); Packaging: Cut Tape (CT); Package / Case: 1206 (3216 Metric); Size / Dimension: 3.20mm L x 1.60mm W; Height: 0.75mm; Mounting Type: Surface Mount; Luminous Flux @ Current - Test: -; ComponentLink1URL: http://www.kingbrightusa.com/images/catalog/SPEC/APT3216SRCPRV.pdf; ComponentLink1Description: Spec Sheet; Supplier Part Number 1: 754-1142-1-ND
D11 = Green LED 1206: Manufacturer: Kingbright; Manufacturer Part Number: APL3015SGC-F01; Color: Green; Wavelength - Dominant: 568nm; Wavelength - Peak: 565nm; Millicandela Rating: 20mcd; Voltage - Forward (Vf) (Typ): 2.2V; Current - Test: 20mA; Viewing Angle: 70°; Lens Type: Clear; Lens Style/Size: Rectangle with Flat Top, 2mm x 1.6mm; Value: Green LED 1206; Supplier 1: Digi-Key; Supplier Part Number 1: 754-1111-1-ND; RoHS: RoHS Compliant; Category: Optoelectronics; Stock 1: 31522; Pricing 1: 1=0.21, 10=0.156, 25=0.1248, 100=0.1127, 250=0.104, 500=0.09362 (CAD); Packaging: Cut Tape (CT); Package / Case: 2-SMD, No Lead; Size / Dimension: 3.00mm L x 1.50mm W; Height: 1.40mm; Mounting Type: Surface Mount; Luminous Flux @ Current - Test: -; ComponentLink1URL: http://www.kingbrightusa.com/images/catalog/SPEC/APL3015SGC-F01.pdf; ComponentLink1Description: Spec Sheet
R1 R18 = 100R 0603 1%: 1/8W; Manufacturer: Yageo; Manufacturer Part Number: RC0603FR-07100RL; Power (Watts): 0.1W, 1/10W; Temperature Coefficient: ±100ppm/°C; Value: 100R 0603 1%; Supplier 1: Digi-Key; RoHS: RoHS Compliant; Category: Resistors; Stock 1: 2116183; Pricing 1: 1=0.1, 10=0.015, 25=0.0108, 100=0.006, 250=0.00456, 500=0.00364, 1000=0.00268, 2500=0.00233 (USD); Packaging: Cut Tape (CT); Tolerance: ±1%; Composition: Thick Film; Features: Moisture Resistant; Operating Temperature: -55°C ~ 155°C; Package / Case: 0603 (1608 Metric); Supplier Device Package: 0603; Size / Dimension: 0.063" L x 0.031" W (1.60mm x 0.80mm); Height: 0.022" (0.55mm); Number of Terminations: 2; ComponentLink1URL: http://www.yageo.com/NewPortal/yageodocoutput?fileName=/pdf/R-Chip/PYu-RC_Group_51_RoHS_L_0.pdf; ComponentLink1Description: http://www.yageo.com/NewPortal/yageodocoutput?fileName=/pdf/R-Chip/PYu-RC_Group_51_RoHS_L_0.pdf; Supplier Part Number 1: 311-100HRCT-ND
R22 = 1.54k 0603 1%: Manufacturer: Yageo; Manufacturer Part Number: RC0603FR-071K54L; Power (Watts): 0.1W, 1/10W; Temperature Coefficient: ±100ppm/°C; Value: 1.54k 0603 1%; Supplier 1: Digi-Key; RoHS: RoHS Compliant; Category: Resistors; Stock 1: 163691; Pricing 1: 1=0.1, 10=0.015, 100=0.006, 1000=0.00268, 2500=0.00233 (USD); Packaging: Cut Tape (CT); Tolerance: ±1%; Composition: Thick Film; Features: Moisture Resistant; Operating Temperature: -55°C ~ 155°C; Package / Case: 0603 (1608 Metric); Supplier Device Package: 0603; Size / Dimension: 0.063" L x 0.031" W (1.60mm x 0.80mm); ComponentLink1URL: http://www.yageo.com/documents/recent/PYu-RC_Group_51_RoHS_L_7.pdf; ComponentLink1Description: Spec Sheet; Supplier Part Number 1: 311-1.54KHRCT-ND; Part Status: Active; Height - Seated (Max): 0.022" (0.55mm); Failure Rate: -
R23 Rt3 = 2k 0603 1%: Manufacturer: Panasonic Electronic Components; Manufacturer Part Number: ERJ-3EKF2001V; Power (Watts): 0.1W, 1/10W; Temperature Coefficient: ±100ppm/°C; Value: 2k 0603 1%; Supplier 1: Digi-Key; RoHS: RoHS Compliant; Category: Resistors; Stock 1: 1444697; Pricing 1: 1=0.1, 50=0.0114, 100=0.0084, 250=0.00644, 500=0.00514, 1000=0.00379 (USD); Packaging: Cut Tape (CT); Tolerance: ±1%; Composition: Thick Film; Features: Automotive AEC-Q200; Operating Temperature: -55°C ~ 155°C; Package / Case: 0603 (1608 Metric); Supplier Device Package: 0603; Size / Dimension: 0.063" L x 0.031" W (1.60mm x 0.80mm); Height: 0.022" (0.55mm); Number of Terminations: 2; ComponentLink1URL: http://industrial.panasonic.com/www-cgi/jvcr13pz.cgi?E+PZ+3+AOA0002+ERJ3EKF2001V+7+WW; ComponentLink1Description: Spec Sheet; Supplier Part Number 1: P2.00KHCT-ND
Rb2 = Thermistor 10k Type J SMT: Resistor; Manufacturer: TDK Corporation; Manufacturer Part Number: NTCG163JF103FTDS; B25/50: 3380K; B25/85: 3435K; Value: Thermistor 10k Type J SMT; Supplier 1: Digi-Key; RoHS: RoHS Compliant; Category: Sensors, Transducers; Stock 1: 5895; Pricing 1: 1=0.3, 5=0.282, 10=0.251, 25=0.2312, 50=0.1848, 100=0.1584, 500=0.1386, 1000=0.1188 (USD); Packaging: Cut Tape (CT); Part Status: Active; B Value Tolerance: ±1%; B0/50: -; B25/75: -; B25/100: -; Operating Temperature: -40°C ~ 125°C; Power - Max: -; Length - Lead Wire: -; Mounting Type: Surface Mount; ComponentLink1URL: https://product.tdk.com/info/en/catalog/datasheets/tpd_automotive_ntc-thermistor_ntcg_en.pdf; ComponentLink1Description: Spec Sheet; Supplier Part Number 1: 445-174516-1-ND
Rf1 = 6.34k 0603 1%: Manufacturer: Yageo; Manufacturer Part Number: RC0603FR-076K34L; Power (Watts): 0.1W, 1/10W; Temperature Coefficient: ±100ppm/°C; Value: 6.34k 0603 1%; Supplier 1: Digi-Key; RoHS: RoHS Compliant; Category: Resistors; Stock 1: 245792; Pricing 1: 1=0.1, 10=0.015, 100=0.006, 1000=0.00268, 2500=0.00233 (USD); Packaging: Cut Tape (CT); Part Status: Active; Tolerance: ±1%; Composition: Thick Film; Features: Moisture Resistant; Operating Temperature: -55°C ~ 155°C; Package / Case: 0603 (1608 Metric); Supplier Device Package: 0603; Size / Dimension: 0.063" L x 0.031" W (1.60mm x 0.80mm); Height - Seated (Max): 0.022" (0.55mm); Failure Rate: -; ComponentLink1URL: http://www.yageo.com/documents/recent/PYu-RC_Group_51_RoHS_L_7.pdf; ComponentLink1Description: Spec Sheet; Supplier Part Number 1: 311-6.34KHRCT-ND
U4 = Single Comparator LTC6752: Manufacturer: Linear Technology; Output Type: CMOS; Voltage - Supply, Single/Dual (±): 2.45 V ~ 5.25 V; Voltage - Input Offset (Max): 5.5mV @ 5V; Current - Input Bias (Max): 1.6µA @ 5V; Current - Output (Typ): 19mA @ 5V; Current - Quiescent (Max): 2.65mA; Propagation Delay (Max): 5.3ns; Value: Comparator LTC6752; Supplier 1: Digi-Key; RoHS: RoHS Compliant; Category: Integrated Circuits (ICs); Stock 1: 612; Pricing 1: 1=4, 25=3.5676, 100=2.268, 250=2.079 (USD); Packaging: Cut Tape (CT); Part Status: Active; Type: General Purpose; CMRR, PSRR (Typ): -; Hysteresis: -; Operating Temperature: -40°C ~ 85°C; Package / Case: SOT-23-5 Thin, TSOT-23-5; Mounting Type: Surface Mount; Supplier Device Package: TSOT-23-5; ComponentLink1URL: http://www.linear.com/docs/45780; ComponentLink1Description: Spec Sheet; Supplier Part Number 1: LTC6752IS5#TRMPBFCT-ND

## Sheet Full-Wave Rectifier.schdoc: Title
size A4; Date: Date; CheckedBy: Checked By; SheetNumber: x; SheetTotal: y; DesignedBy: Designed By
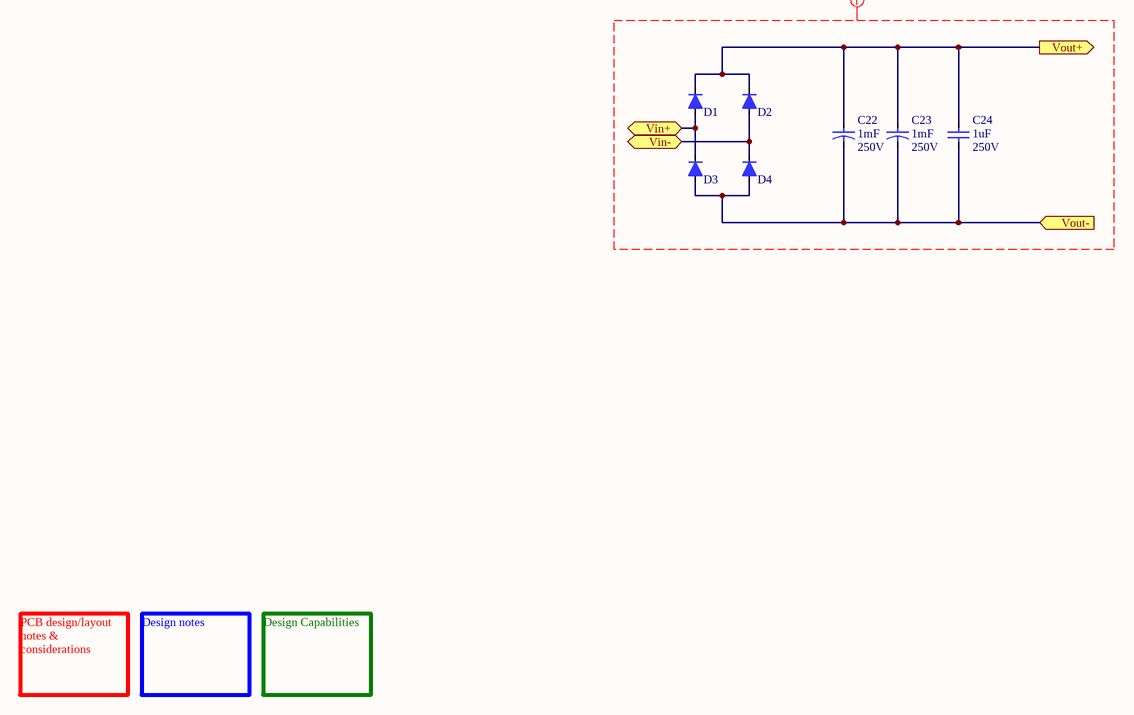
[diagram p4: Full-Wave Rectifier.schdoc]

### Parts
(Parts that share a designator on the sheet are numbered #1, #2 ... from top to bottom, then left to right.)
C22  Capacitance: 1mF  Voltage: 250V  (hidden comment: 1mF Radial 250V)
C23  Capacitance: 1mF  Voltage: 250V  (hidden comment: 1mF Radial 250V)
C24  Voltage - Rated: 250V  Capacitance: 1uF  (hidden comment: 1uF 2220 250V)
D1#1  Diode - Signal 1A  (value not drawn)
D2  Diode - Signal 1A  (value not drawn)
D3  Diode - Signal 1A  (value not drawn)
D4  Diode - Signal 1A  (value not drawn)

### Ports
Vin+ (bidir), Vin- (bidir), Vout+ (out), Vout- (in)

### Nets
HVGND: C22.2 C23.2 C24.2 D3.1(Anode) D4.1(Anode) ; port Vout-
+DC Bus: C22.1 C23.1 C24.1 D1#1.2(Cathode) D2.2(Cathode) ; port Vout+
+VT1.S: D1#1.1(Anode) D3.2(Cathode) ; port Vin+
NetD2_1: D2.1(Anode) D4.2(Cathode) ; port Vin-

### Layout directives
net class 171-250V: (no net found under the mark)

### Notes on the sheet
- PCB design/layout notes & considerations
- Design notes
- Design Capabilities
- Repository Version
- BOM/Variant

### Library data of the parts
C22 C23 = 1mF Radial 250V: Polarized; Manufacturer: Nichicon; Manufacturer Part Number: LGG2E102MELB40; Tolerance: ±20%; Lifetime @ Temp.: 2000 Hrs @ 105°C; Polarization: Polar; Ripple Current - Low Frequency: 2.2A @ 120Hz; Ripple Current - High Frequency: 3.3A @ 50kHz; Value: 1mF Radial 250V; Supplier 1: Digi-Key; RoHS: RoHS Compliant; Category: Capacitors; Stock 1: 221; Pricing 1: 1=4.59, 10=4.129, 100=3.1198, 500=2.56926, 1000=2.38575, 2500=2.37701 (USD); Packaging: Bulk; Part Status: Active; ESR (Equivalent Series Resistance): -; Operating Temperature: -40°C ~ 105°C; Applications: General Purpose; Lead Spacing: 0.394" (10.00mm); Size / Dimension: 1.181" Dia (30.00mm); Height - Seated (Max): 1.654" (42.00mm); Surface Mount Land Size: -; Mounting Type: Through Hole; Package / Case: Radial, Can - Snap-In; ComponentLink1URL: http://nichicon-us.com/english/products/pdfs/e-lgg.pdf; ComponentLink1Description: Spec Sheet; Supplier Part Number 1: 493-8169-ND
C24 = 1uF 2220 250V: Non-polarized; Manufacturer: Murata Electronics North America; Manufacturer Part Number: GRM55DR72E105KW01L; Tolerance: ±10%; Temperature Coefficient: X7R; Value: 1uF 2220 250V; Supplier 1: Digi-Key; RoHS: RoHS Compliant; Category: Capacitors; Stock 1: 174481; Pricing 1: 1=0.89, 10=0.678, 100=0.4853, 500=0.3757 (USD); Packaging: Cut Tape (CT); Part Status: Active; Operating Temperature: -55°C ~ 125°C; Features: -; Ratings: -; Applications: General Purpose; Mounting Type: Surface Mount, MLCC; Package / Case: 2220 (5750 Metric); Size / Dimension: 0.224" L x 0.197" W (5.70mm x 5.00mm); Height - Seated (Max): -; Thickness (Max): 0.087" (2.20mm); Lead Spacing: -; Lead Style: -; ComponentLink1URL: http://search.murata.co.jp/Ceramy/image/img/A01X/G101/ENG/GRM55DR72E105KW01-01.pdf; ComponentLink1Description: Spec Sheet; Supplier Part Number 1: 490-3550-1-ND
D1#1 D2-D4 = Diode - Signal 1A: Signal Diode; Manufacturer: Vishay Semiconductor Diodes Division; Manufacturer Part Number: US1G-E3/5AT; Diode Type: Standard; Voltage - DC Reverse (Vr) (Max): 400V; Voltage - Forward (Vf) (Max) @ If: 1V @ 1A; Speed: Fast Recovery =< 500ns, > 200mA (Io); Reverse Recovery Time (trr): 50ns; Current - Reverse Leakage @ Vr: 10µA @ 400V; Capacitance @ Vr, F: 15pF @ 4V, 1MHz; Supplier 1: Digi-Key; Supplier Part Number 1: US1G-E3/5ATGICT-ND; RoHS: RoHS Compliant; Category: Discrete Semiconductor Products; Stock 1: 29002; Pricing 1: 1=0.41, 10=0.312, 25=0.2816, 100=0.1945, 250=0.1638, 500=0.1331, 1000=0.10238, 2500=0.09214 (USD); Packaging: Cut Tape (CT); Part Status: Active; Current - Average Rectified (Io): 1A; Mounting Type: Surface Mount; Package / Case: DO-214AC, SMA; Supplier Device Package: DO-214AC (SMA); Operating Temperature - Junction: -55°C ~ 150°C; ComponentLink1URL: http://www.vishay.com/docs/88768/us1.pdf; ComponentLink1Description: Spec Sheet

## Sheet High Voltage H-Bridge.SchDoc: High Voltage H-Bridge
size A4; Date: 2017-01-26; DocumentNumber: 7; Revision: A; SheetNumber: 7; SheetTotal: 16; DesignedBy: Mike MacKay
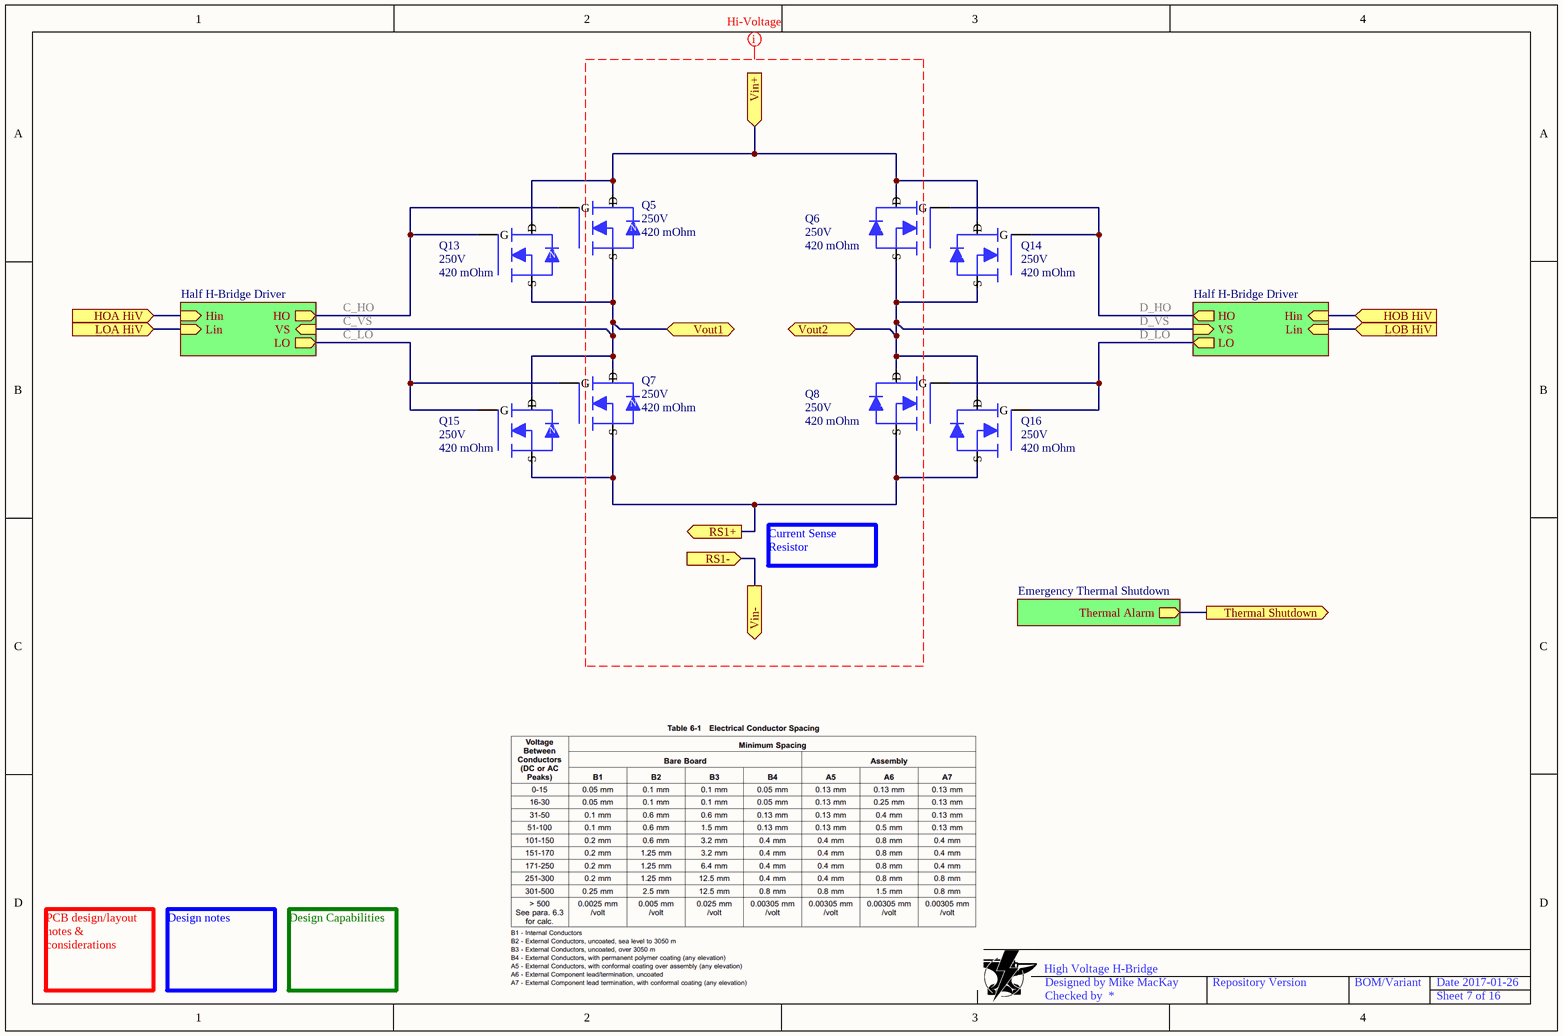
[diagram p5: High Voltage H-Bridge.SchDoc]

### Parts
Q5  Drain to Source Voltage (Vdss): 250V  Rds On (Max) @ Id, Vgs: 420 mOhm  [DPAK]  (hidden comment: N-MOSFET 420mR 250V)
Q6  Drain to Source Voltage (Vdss): 250V  Rds On (Max) @ Id, Vgs: 420 mOhm  [DPAK]  (hidden comment: N-MOSFET 420mR 250V)
Q7  Drain to Source Voltage (Vdss): 250V  Rds On (Max) @ Id, Vgs: 420 mOhm  [DPAK]  (hidden comment: N-MOSFET 420mR 250V)
Q8  Drain to Source Voltage (Vdss): 250V  Rds On (Max) @ Id, Vgs: 420 mOhm  [DPAK]  (hidden comment: N-MOSFET 420mR 250V)
Q13  Drain to Source Voltage (Vdss): 250V  Rds On (Max) @ Id, Vgs: 420 mOhm  [DPAK]  (hidden comment: N-MOSFET 420mR 250V)
Q14  Drain to Source Voltage (Vdss): 250V  Rds On (Max) @ Id, Vgs: 420 mOhm  [DPAK]  (hidden comment: N-MOSFET 420mR 250V)
Q15  Drain to Source Voltage (Vdss): 250V  Rds On (Max) @ Id, Vgs: 420 mOhm  [DPAK]  (hidden comment: N-MOSFET 420mR 250V)
Q16  Drain to Source Voltage (Vdss): 250V  Rds On (Max) @ Id, Vgs: 420 mOhm  [DPAK]  (hidden comment: N-MOSFET 420mR 250V)

### Sub-sheets
Emergency Thermal Shutdown = Emergency Thermal Shutdown.SchDoc: Thermal Alarm (out)
Half H-Bridge Driver = Half H-Bridge Driver.SchDoc: HO (out), VS (in), LO (out), Hin (in), Lin (in)
Half H-Bridge Driver = Half H-Bridge Driver.SchDoc: HO (out), VS (in), LO (out), Hin (in), Lin (in)

### Ports
HOA HiV (in), HOB HiV (in), LOA HiV (in), LOB HiV (in), RS1+ (out), RS1- (in), Thermal Shutdown (out), Vin+ (in), Vin- (out), Vout1 (bidir), Vout2 (bidir)

### Nets
HVGND: port Vin-, port RS1-
+DC Bus: Q5.2(D) Q6.2(D) Q13.2(D) Q14.2(D) ; port Vin+
C_HO: Q5.1(G) Q13.1(G) ; sheet Half H-Bridge Driver/HO
C_LO: Q7.1(G) Q15.1(G) ; sheet Half H-Bridge Driver/LO
C_VS: Q5.3(S) Q7.2(D) Q13.3(S) Q15.2(D) ; port Vout1, sheet Half H-Bridge Driver/VS
D_HO: Q6.1(G) Q14.1(G) ; sheet Half H-Bridge Driver/HO
D_LO: Q8.1(G) Q16.1(G) ; sheet Half H-Bridge Driver/LO
D_VS: Q6.3(S) Q8.2(D) Q14.3(S) Q16.2(D) ; port Vout2, sheet Half H-Bridge Driver/VS
NetNetTie5_2: Q7.3(S) Q8.3(S) Q15.3(S) Q16.3(S) ; port RS1+
NetR1B_1: port Thermal Shutdown, sheet Emergency Thermal Shutdown/Thermal Alarm
NetU1#2_31: port LOA HiV, sheet Half H-Bridge Driver/Lin
NetU1#2_32: port LOB HiV, sheet Half H-Bridge Driver/Lin
NetU1#2_33: port HOA HiV, sheet Half H-Bridge Driver/Hin
NetU1#2_34: port HOB HiV, sheet Half H-Bridge Driver/Hin

### Layout directives
net class 171-250V: (no net found under the mark)

### Notes on the sheet
- Current Sense Resistor
- PCB design/layout notes & considerations
- Design notes
- Design Capabilities
- Repository Version
- BOM/Variant
- (in symbol N-MOSFET 420mR 250V) N

### Library data of the parts
Q5-Q8 Q13-Q16 = N-MOSFET 420mR 250V: Manufacturer: Fairchild/ON Semiconductor; Manufacturer Part Number: FQD9N25TM; FET Type: N-Channel; Current - Continuous Drain (Id) @ 25°C: 7.4A (Tc); Drive Voltage (Max Rds On,  Min Rds On): 10V; Vgs(th) (Max) @ Id: 5V @ 250µA; Gate Charge (Qg) (Max) @ Vgs: 20nC @ 10V; Input Capacitance (Ciss) (Max) @ Vds: 700pF @ 25V; Vgs (Max): ±30V; Power Dissipation (Max): 2.5W (Ta), 55W (Tc); Supplier 1: Digi-Key; Supplier Part Number 1: FQD9N25TMCT-ND; RoHS: RoHS Compliant; Category: Discrete Semiconductor Products; Stock 1: 4941; Pricing 1: 1=0.86, 10=0.766, 100=0.597, 500=0.49316, 1000=0.38934 (USD); Packaging: Cut Tape (CT); Part Status: Active; Technology: MOSFET (Metal Oxide); FET Feature: -; Operating Temperature: -55°C ~ 150°C (TJ); Mounting Type: Surface Mount; Supplier Device Package: D-Pak; Package / Case: TO-252-3, DPak (2 Leads + Tab), SC-63; ComponentLink1URL: https://www.fairchildsemi.com/datasheets/FQ/FQD9N25.pdf; ComponentLink1Description: Spec Sheet

## Sheet Transformer.SchDoc: Title
size A4; Date: Date; CheckedBy: Checked By; SheetNumber: x; SheetTotal: y; DesignedBy: Designed By
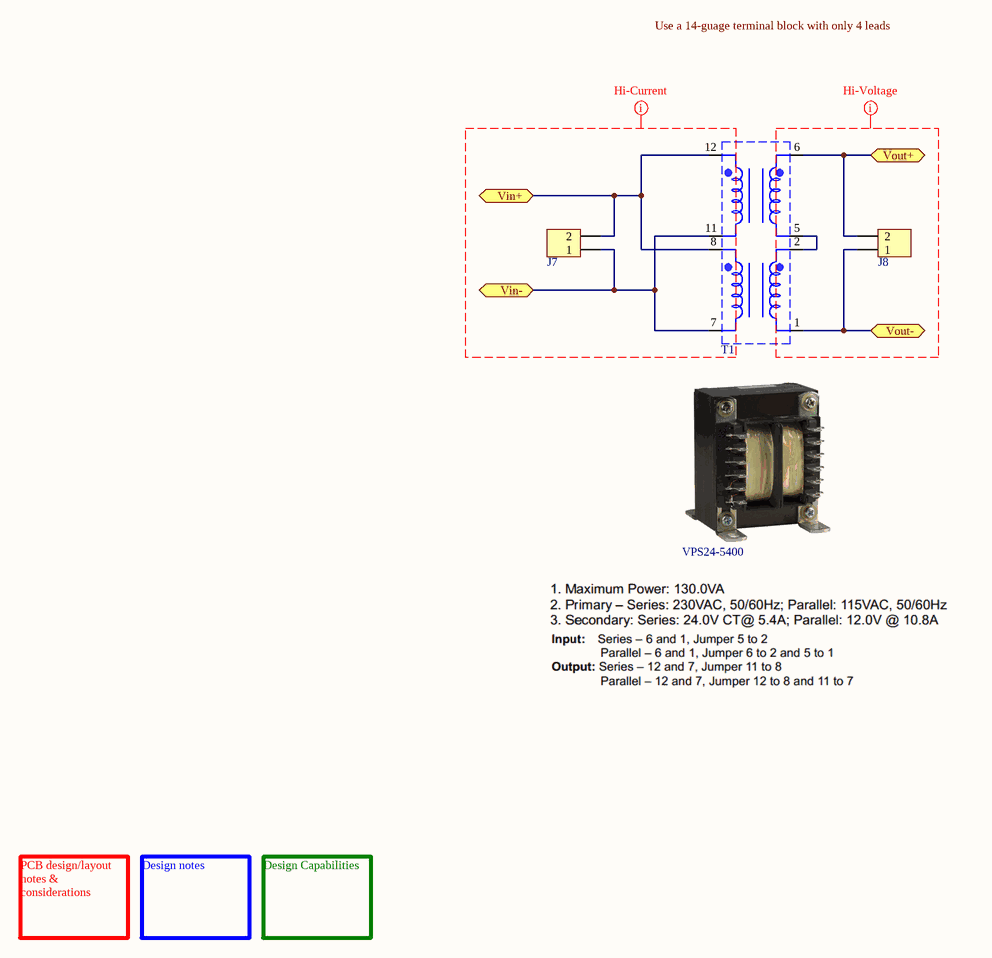
[diagram p6: Transformer.SchDoc]

### Parts
J7  Terminal Block - 2-Position HiV/HiA  [TE 796739-2]  (value not drawn)
J8  Terminal Block - 2-Position HiV/HiA  [TE 796739-2]  (value not drawn)
T1  Transformer Connector  (value not drawn)  (graphical)
Transformer1  Manufacturer Part Number: VPS24-5400  [Transformer]  (hidden comment: Transformer)

### Ports
Vin+ (bidir), Vin- (bidir), Vout+ (bidir), Vout- (bidir)

### Nets
+VT1.P: J7.2 T1.8 T1.12 ; port Vin+
+VT1.S: J8.2 T1.6 ; port Vout+
-VT1.P: J7.1 T1.7 T1.11 ; port Vin-
NetD2_1: J8.1 T1.1 ; port Vout-
NetT1_2: T1.2 T1.5

### Layout directives
net class 171-250V: (no net found under the mark)
net class 15A: (no net found under the mark)

### Notes on the sheet
- PCB design/layout notes & considerations
- Design notes
- Design Capabilities
- Labels drawn without touching a wire or pin: Use a 14-guage terminal block with only 4 leads
- Repository Version
- BOM/Variant

### Library data of the parts
J7 J8 = Terminal Block - 2-Position HiV/HiA: as J3 on sheet Overview; Supplier 1: Digi-Key; RoHS: RoHS Compliant; Category: Connectors, Interconnects; Stock 1: 14124; Pricing 1: 1=2.21, 10=1.673, 25=1.5504, 50=1.394, 100=1.36, 250=1.19, 500=1.088, 1000=0.986, 2500=0.884 (USD); Packaging: Tray; Part Status: Active; Mounting Type: Through Hole; Features: Interlocking (Side); Color: Green; Operating Temperature: -; Housing Material: Polyamide (PA66), Nylon 6/6; Contact Material - Plating: -; Screw Material - Plating: Brass - Nickel Plated; ComponentLink1URL: http://www.te.com/commerce/DocumentDelivery/DDEController?Action=srchrtrv&DocNm=796739&DocType=Customer+Drawing&DocLang=English; ComponentLink1Description: Spec Sheet; Supplier Part Number 1: A98273-ND
Transformer1 = Transformer: Manufacturer: Triad Magnetics; Voltage - Primary: 115V, 230V; Voltage - Secondary (Full Load): Parallel 12V, Series 24V; Current - Output (Max): Parallel 10.8A, Series 5.4A; Primary Winding(s): Dual; Center Tap: No; Power - Max: 130 VA; Voltage - Isolation: 4000Vrms; Supplier 1: Digi-Key; RoHS: RoHS Compliant; Category: Transformers; Stock 1: 223; Pricing 1: 1=27.01, 10=23.831, 25=23.0364, 50=20.6534, 100=19.8591 (USD); Part Status: Active; Type: Laminated Core; Secondary Winding(s): Dual; Mounting Type: Chassis Mount; Termination Style: Solder, Quick Connect; Size / Dimension: 60.45mm L x 68.33mm W; Height - Seated (Max): 85.85mm; ComponentLink1URL: http://catalog.triadmagnetics.com/Asset/VPS24-5400.pdf; ComponentLink1Description: Spec Sheet; Supplier Part Number 1: 237-1277-ND

## Sheet Powersupply.SchDoc: 3.3VDC Powersupply
size A4; Date: 2017-08-24; DocumentNumber: 9; Revision: C; SheetNumber: 9; SheetTotal: 16; DesignedBy: Craig Comberbach
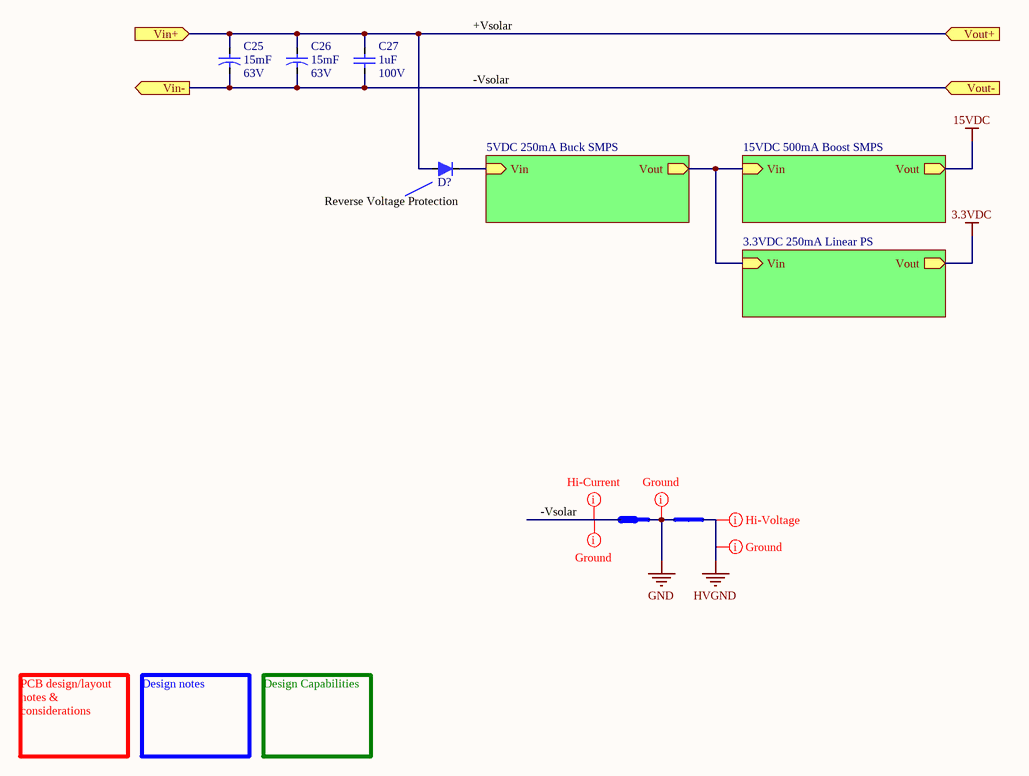
[diagram p7: Powersupply.SchDoc]

### Parts
C25  Capacitance: 15mF  Voltage: 63V  (hidden comment: 15mF Radial 63V)
C26  Capacitance: 15mF  Voltage: 63V  (hidden comment: 15mF Radial 63V)
C27  Voltage - Rated: 100V  Capacitiance: 1uF  (hidden comment: 1uF 1206 100V)
D?  Diode - Signal 1A  (value not drawn)
NetTie2  Net Tie - Same Size  (value not drawn)  (net tie, no BOM)
NetTie10  Net Tie - Different Sizes  (value not drawn)  (net tie, no BOM)

### Sub-sheets
3.3VDC 250mA Linear PS = 3.3VDC 250mA Linear PS.SchDoc: Vin (in), Vout (out)
5VDC 250mA Buck SMPS = 5VDC 250mA Buck SMPS.SchDoc: Vin (in), Vout (out)
15VDC 500mA Boost SMPS = 15VDC 500mA Boost SMPS.SchDoc: Vin (in), Vout (out)

### Ports
Vin+ (in), Vin- (out), Vout+ (in), Vout- (in)

### Nets
GND: NetTie2.2 NetTie10.1 ; sheet 15VDC 500mA Boost SMPS/Vin, sheet 3.3VDC 250mA Linear PS/Vin, sheet 5VDC 250mA Buck SMPS/Vout
HVGND: NetTie2.1
+Vsolar: C25.1 C26.1 C27.1 D?.1(Anode) ; port Vin+, port Vout+
-Vsolar: C25.2 C26.2 C27.2 NetTie10.2 ; port Vin-, port Vout-
NetC3_1: D?.2(Cathode) ; sheet 5VDC 250mA Buck SMPS/Vin

### Layout directives
net class 15A: -Vsolar
net class 171-250V: HVGND
net class Grounds: -Vsolar, GND, HVGND

### Notes on the sheet
- (near D?) Reverse Voltage Protection
- PCB design/layout notes & considerations
- Design notes
- Design Capabilities
- Repository Version
- BOM/Variant

### Library data of the parts
C25 C26 = 15mF Radial 63V: Polarized; Manufacturer: United Chemi-Con; Manufacturer Part Number: EKMH630VSN153MA63T; Tolerance: ±20%; ESR (Equivalent Series Resistance): 14 mOhm @ 120Hz; Lifetime @ Temp.: 2000 Hrs @ 105°C; Polarization: Polar; Ripple Current - Low Frequency: 4.88A @ 120Hz; Ripple Current - High Frequency: 5.856A @ 100kHz; Value: 15mF Radial 63V; Supplier 1: Digi-Key; RoHS: RoHS Compliant; Category: Capacitors; Stock 1: 194; Pricing 1: 1=7.02, 10=6.237, 100=4.9896, 500=4.28794, 1000=4.0392 (USD); Packaging: Bulk; Part Status: Active; Operating Temperature: -40°C ~ 105°C; Applications: General Purpose; Lead Spacing: 0.394" (10.00mm); Size / Dimension: 1.378" Dia (35.00mm); Height - Seated (Max): 2.559" (65.00mm); Surface Mount Land Size: -; Mounting Type: Through Hole; Package / Case: Radial, Can - Snap-In; ComponentLink1URL: http://www.chemi-con.co.jp/cgi-bin/CAT_DB/SEARCH/cat_db_al.cgi?e=e&j=p&pdfname=kmhlug; ComponentLink1Description: Spec Sheet; Supplier Part Number 1: 565-4208-ND
C27 = 1uF 1206 100V: Non-polarized; Manufacturer: Samsung Electro-Mechanics America, Inc.; Manufacturer Part Number: CL31B105KCHNNNE; Tolerance: ±10%; Temperature Coefficient: X7R; Value: 1uF 1206 100V; Supplier 1: Digi-Key; RoHS: RoHS Compliant; Category: Capacitors; Stock 1: 479067; Pricing 1: 1=0.32, 10=0.221, 100=0.1326, 500=0.09942, 1000=0.08396 (USD); Packaging: Cut Tape (CT); Part Status: Active; Operating Temperature: -55°C ~ 125°C; Features: -; Ratings: -; Applications: General Purpose; Mounting Type: Surface Mount, MLCC; Package / Case: 1206 (3216 Metric); Size / Dimension: 0.126" L x 0.063" W (3.20mm x 1.60mm); Height - Seated (Max): -; Thickness (Max): 0.071" (1.80mm); Lead Spacing: -; Lead Style: -; ComponentLink1URL: http://media.digikey.com/pdf/Data%20Sheets/Samsung%20PDFs/CL_Series_MLCC_ds.pdf; ComponentLink1Description: Spec Sheet; Supplier Part Number 1: 1276-1838-1-ND
D? = Diode - Signal 1A: as D1#1 on sheet Full-Wave Rectifier; Supplier 1: Digi-Key; Supplier Part Number 1: US1G-E3/5ATGICT-ND; RoHS: RoHS Compliant; Category: Discrete Semiconductor Products; Stock 1: 29002; Pricing 1: 1=0.41, 10=0.312, 25=0.2816, 100=0.1945, 250=0.1638, 500=0.1331, 1000=0.10238, 2500=0.09214 (USD); Packaging: Cut Tape (CT); Part Status: Active; Current - Average Rectified (Io): 1A; Mounting Type: Surface Mount; Package / Case: DO-214AC, SMA; Supplier Device Package: DO-214AC (SMA); Operating Temperature - Junction: -55°C ~ 150°C; ComponentLink1URL: http://www.vishay.com/docs/88768/us1.pdf; ComponentLink1Description: Spec Sheet
NetTie2 = Net Tie - Same Size: Ties two nets together
NetTie10 = Net Tie - Different Sizes: Ties two nets together